# EAGLE design TSOC-ESP8266-EM (EAGLE 6.6.0)
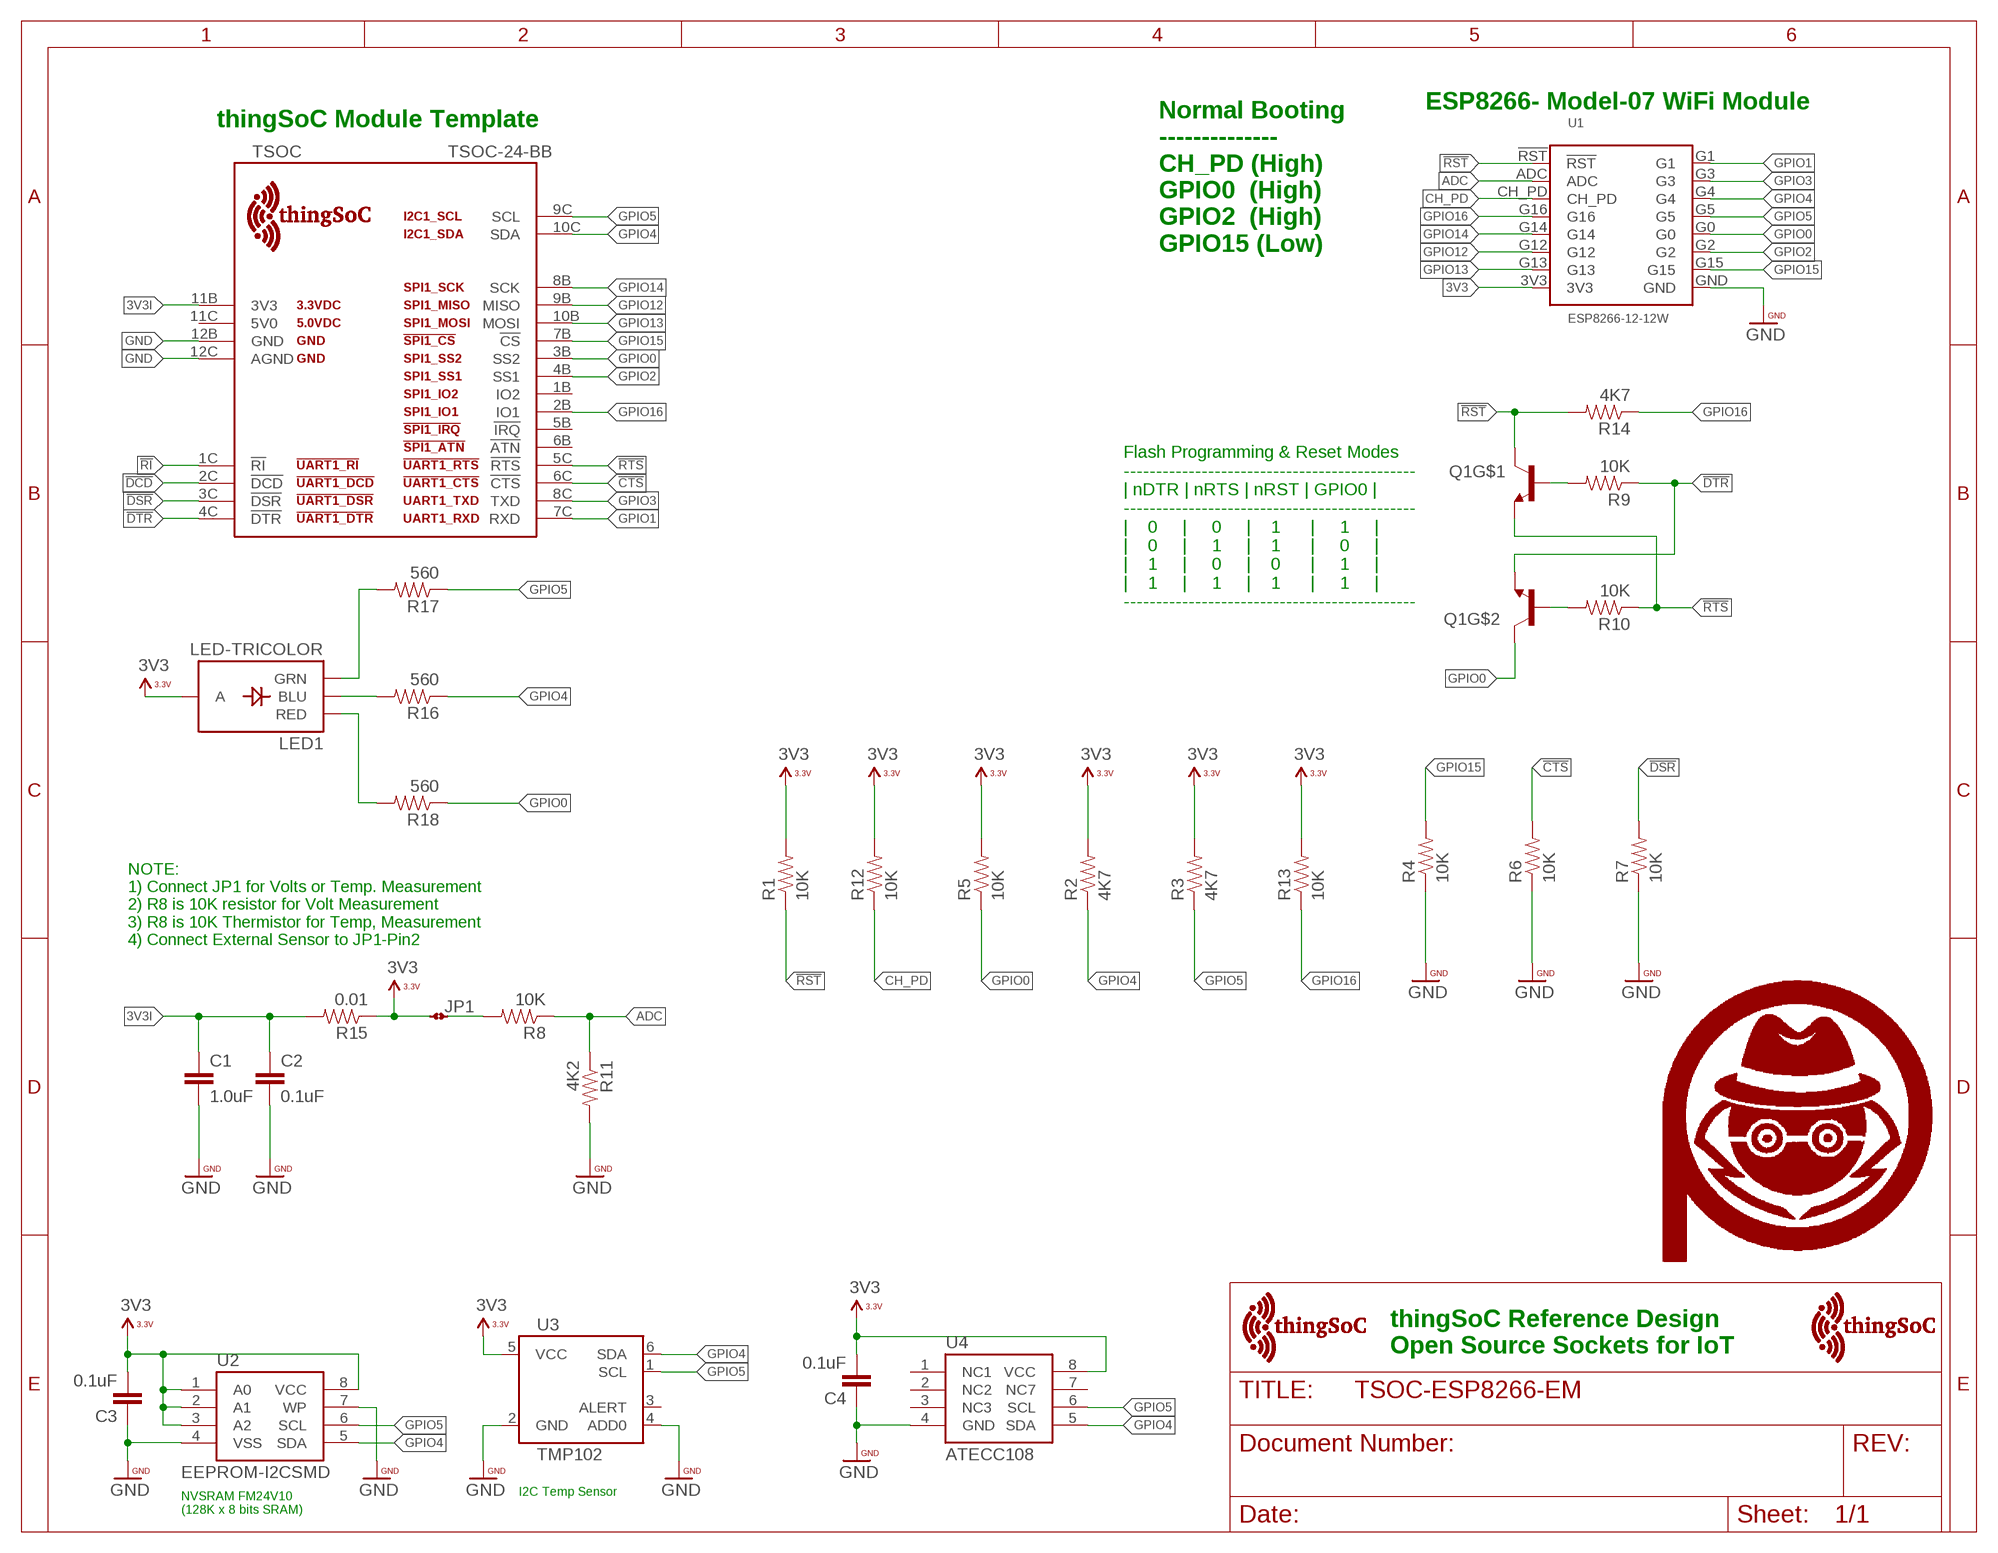
[diagram p0: schematic, sheet 1]

## Parts
C1  1.0uF  CAP0402-CAP  [0402-CAP]
C2  0.1uF  CAP0402-CAP  [0402-CAP]
C3  0.1uF  CAP0402-CAP  [0402-CAP]
C4  0.1uF  CAP0402-CAP  [0402-CAP]
JP1  JMP-2-NO-0402  [JMP-2-NO-0402]
LED1  LED-TRICOLOR  [LED-TRICOLOR-SMD]
Q1  MMBT2222A  MMDT3904  [SOT363]
R1  10K  RESISTOR0402  [0402-RES]
R2  4K7  RESISTOR0402  [0402-RES]
R3  4K7  RESISTOR0402  [0402-RES]
R4  10K  RESISTOR0402  [0402-RES]
R5  10K  RESISTOR0402  [0402-RES]
R6  10K  RESISTOR0402  [0402-RES]
R7  10K  RESISTOR0402  [0402-RES]
R8  10K  RESISTOR0402  [0402-RES]
R9  10K  RESISTOR0402  [0402-RES]
R10  10K  RESISTOR0402  [0402-RES]
R11  4K2  RESISTOR0402  [0402-RES]
R12  10K  RESISTOR0402  [0402-RES]
R13  10K  RESISTOR0402  [0402-RES]
R14  4K7  RESISTOR0402  [0402-RES]
R15  0.01  RESISTOR0402  [0402-RES]
R16  560  RESISTOR0402  [0402-RES]
R17  560  RESISTOR0402  [0402-RES]
R18  560  RESISTOR0402  [0402-RES]
TSOC  TSOC-24-BB  [TSOC-BB-S24]
U1  ESP8266-12-12W  [ESP8266-12W]
U2  EEPROM-I2CSMD  [SO08]
U3  TMP102  [SOT563]
U4  ATECC108  [SOIC8]
U$11  PA_LOGO_SYMMED  [PA_LOGO_AGENT_MED_SYM]
U$19  TSOC-LOGO-MED  [TSOC-LOGO-MED]
U$20  TSOC-LOGO-MED  [TSOC-LOGO-MED]

## Nets
3V3: C3.2 C4.2 JP1.1 LED1.A R1.2 R2.2 R3.2 R5.2 R12.2 R13.2 R15.1 U1.3V3 U2.1(A0) U2.2(A1) U2.3(A2) U2.8(VCC) U3.5(VCC) U4.8(VCC)
3V3I: C1.1 C2.1 R15.2 TSOC.11B(3V3)
!CTS: R6.2 TSOC.6C(!CTS)
!DCD: TSOC.2C(!DCD)
!DSR: R7.2 TSOC.3C(!DSR)
!DTR: Q1.1(E) R9.1 TSOC.4C(!DTR)
!RI: TSOC.1C(!RI)
!RST: Q1.3(C) R1.1 R14.2 U1.!RST
!RTS: Q1.4(E) R10.1 TSOC.5C(!RTS)
ADC: R8.1 R11.1 U1.ADC
ADC_RAW: JP1.2 R8.2
BLU: LED1.B(BLU) R16.2
CH_PD: R12.1 U1.CH_PD
GND: C1.2 C2.2 C3.1 C4.1 R4.1 R6.1 R7.1 R11.2 TSOC.12B(GND) TSOC.12C(AGND) U1.GND U2.4(VSS) U2.7(WP) U3.2(GND) U3.4(ADD0)
GPIO0: Q1.6(C) R5.1 R18.1 TSOC.3B(SS2) U1.G0
GPIO1: TSOC.7C(RXD) U1.G1
GPIO2: TSOC.4B(SS1) U1.G2
GPIO3: TSOC.8C(TXD) U1.G3
GPIO4: R2.1 R16.1 TSOC.10C(SDA) U1.G4 U2.5(SDA) U3.6(SDA) U4.5(SDA)
GPIO5: R3.1 R17.1 TSOC.9C(SCL) U1.G5 U2.6(SCL) U3.1(SCL) U4.6(SCL)
GPIO12: TSOC.9B(MISO) U1.G12
GPIO13: TSOC.10B(MOSI) U1.G13
GPIO14: TSOC.8B(SCK) U1.G14
GPIO15: R4.2 TSOC.7B(!CS) U1.G15
GPIO16: R13.1 R14.1 TSOC.2B(IO1) U1.G16
GRN: LED1.G(GRN) R17.2
N$6: Q1.5(B) R9.2
N$12: Q1.2(B) R10.2
RED: LED1.R(RED) R18.2
Unconnected: TSOC.1B(IO2) TSOC.5B(!IRQ) TSOC.6B(!ATN) TSOC.11C(5V0) U3.3(ALERT) U4.1(NC1) U4.2(NC2) U4.3(NC3) U4.7(NC7)

## Notes on the sheet
- ESP8266- Model-07 WiFi Module
- thingSoC Module Template
- Normal Booting
  --------------
  CH_PD (High)
  GPIO0  (High)
  GPIO2  (High) 
  GPIO15 (Low)
- Flash Programming & Reset Modes
  ---------------------------------------------
  | nDTR | nRTS | nRST | GPIO0 |
  ---------------------------------------------
  |    0     |     0     |    1      |     1     |
  |    0     |     1     |    1      |     0     |
  |    1     |     0     |    0      |     1     |
  |    1     |     1     |    1      |     1     |
  ---------------------------------------------
- NOTE:
  1) Connect JP1 for Volts or Temp. Measurement
  2) R8 is 10K resistor for Volt Measurement
  3) R8 is 10K Thermistor for Temp, Measurement
  4) Connect External Sensor to JP1-Pin2
- thingSoC Reference Design
  Open Source Sockets for IoT
- I2C Temp Sensor
- NVSRAM FM24V10
  (128K x 8 bits SRAM)

## Power pins joined to a net without a drawn wire
GND: U4.4(GND)

## Library data of the parts
C1-C4 = PatternAgents-ProtoPads:CAP: Capacitor Standard 0603 ceramic capacitor, and 0.1" leaded capacitor.
JP1 = PatternAgents-ProtoPads:JMP-2-NO: Two Terminal Jumper - Normally Open Positions 1 and 2 are normally NOT connected. PatternAgents ProtoPads Library Schematic and PCB layout libraries for design patterns by PatternAgents. For the CADSoft Eagle CAD program : http://www.cadsoftusa.com/download-eagle/ Source LBR : http://www.patternagents.com Github : https://github.com/PatternAgents License : http://creativecommons.org/licenses/by-sa/4.0/ (Creative Commons 4.0) THIS SOFTWARE IS PROVIDED BY THE CONTRIBUTORS "AS IS" AND WITHOUT ANY EXPRESS OR IMPLIED WARRANTIES, INCLUDING, BUT NOT LIMITED TO, THE IMPLIED WARRANTIES OF MERCHANTABILITY AND FITNESS FOR A PARTICULAR PURPOSE ARE DISCLAIMED. IN NO EVENT SHALL THE COPYRIGHT OWNER OR CONTRIBUTORS BE LIABLE FOR ANY DIRECT, INDIRECT, INCIDENTAL, SPECIAL, EXEMPLARY, OR CONSEQUENTIAL DAMAGES (INCLUDING, BUT NOT LIMITED TO, PROCUREMENT OF SUBSTITUTE GOODS OR SERVICES; LOSS OF USE, DATA, OR PROFITS; OR BUSINESS INTERRUPTION) HOWEVER CAUSED AND ON ANY THEORY OF LIABILITY, WHETHER IN CONTRACT, STRICT LIABILITY, OR TORT (INCLUDING NEGLIGENCE OR OTHERWISE) ARISING IN ANY WAY OUT OF THE USE OF THIS SOFTWARE, EVEN IF ADVISED OF THE POSSIBILITY OF SUCH DAMAGE.; BOM: EXCLUDE
LED1 = SparkFun-LED:LED-TRICOLOR: Tri-Color LED SMD Proven layout and schematic for triple color LED in SMD package - common anode. Spark Fun Electronics SKU : COM-07844
Q1 = SparkFun-DiscreteSemi:MMDT3904: Dual NPN transistor
R1-R18 = PatternAgents-ProtoPads:RESISTOR: Resistor Basic schematic elements and footprints for 0603, 1206, and PTH resistors.
TSOC = thingSoC:TSOC-24: thingSoC Twenty-Four(24) Pin Socket Source LBR : http://www.thingsoc.com Github : https://github.com/thingsoc License : http://creativecommons.org/licenses/by-sa/4.0/ (Creative Commons 4.0) THIS SOFTWARE IS PROVIDED BY THE CONTRIBUTORS "AS IS" AND WITHOUT ANY EXPRESS OR IMPLIED WARRANTIES, INCLUDING, BUT NOT LIMITED TO, THE IMPLIED WARRANTIES OF MERCHANTABILITY AND FITNESS FOR A PARTICULAR PURPOSE ARE DISCLAIMED. IN NO EVENT SHALL THE COPYRIGHT OWNER OR CONTRIBUTORS BE LIABLE FOR ANY DIRECT, INDIRECT, INCIDENTAL, SPECIAL, EXEMPLARY, OR CONSEQUENTIAL DAMAGES (INCLUDING, BUT NOT LIMITED TO, PROCUREMENT OF SUBSTITUTE GOODS OR SERVICES; LOSS OF USE, DATA, OR PROFITS; OR BUSINESS INTERRUPTION) HOWEVER CAUSED AND ON ANY THEORY OF LIABILITY, WHETHER IN CONTRACT, STRICT LIABILITY, OR TORT (INCLUDING NEGLIGENCE OR OTHERWISE) ARISING IN ANY WAY OUT OF THE USE OF THIS SOFTWARE, EVEN IF ADVISED OF THE POSSIBILITY OF SUCH DAMAGE.
U1 = PatternAgents_RFmodules:ESP8266-12: Pattern Agents ESP8266 (Type12 : 16 Pins) PatternAgents Prototyping/Pads Library Schematic & PCB Layout Symbols for Prototyping Boards. Pads in this library have been lengthened for hand soldering & prototyping. Schematic and PCB layout libraries for design patterns by PatternAgents. For the CADSoft Eagle CAD program : http://www.cadsoftusa.com/download-eagle/ Github : https://github.com/PatternAgents License : http://creativecommons.org/licenses/by-sa/4.0/ (Creative Commons 4.0) THIS SOFTWARE IS PROVIDED BY THE CONTRIBUTORS "AS IS" AND WITHOUT ANY EXPRESS OR IMPLIED WARRANTIES, INCLUDING, BUT NOT LIMITED TO, THE IMPLIED WARRANTIES OF MERCHANTABILITY AND FITNESS FOR A PARTICULAR PURPOSE ARE DISCLAIMED. IN NO EVENT SHALL THE COPYRIGHT OWNER OR CONTRIBUTORS BE LIABLE FOR ANY DIRECT, INDIRECT, INCIDENTAL, SPECIAL, EXEMPLARY, OR CONSEQUENTIAL DAMAGES (INCLUDING, BUT NOT LIMITED TO, PROCUREMENT OF SUBSTITUTE GOODS OR SERVICES; LOSS OF USE, DATA, OR PROFITS; OR BUSINESS INTERRUPTION) HOWEVER CAUSED AND ON ANY THEORY OF LIABILITY, WHETHER IN CONTRACT, STRICT LIABILITY, OR TORT (INCLUDING NEGLIGENCE OR OTHERWISE) ARISING IN ANY WAY OUT OF THE USE OF THIS SOFTWARE, EVEN IF ADVISED OF THE POSSIBILITY OF SUCH DAMAGE.
U2 = SparkFun-DigitalIC:EEPROM-I2C: I2C EEPROM chips, 24LC256 (and others)
U3 = SparkFun-Sensors:TMP102: I2C degC temp sensor; PROD_ID: IC-09303
U4 = SparkFun-DigitalIC:ATECC108: ATECC108: Provides ECDSA with NIST curves P256, B283, and K283. Also, a RNG, 8.5Kb EEPROM. 2.0V - 5.5V.; PROD_ID: IC-11982
U$11 = PatternAgents-Logos:PA_LOGO_SYM: PatternAgents Logo Symbol Trademark : PatternAgents, LLC Github : https://github.com/PatternAgents/PCB_Libraries License : http://creativecommons.org/licenses/by-sa/3.0/ (Creative Commons 3.0) THIS SOFTWARE IS PROVIDED BY THE CONTRIBUTORS "AS IS" AND WITHOUT ANY EXPRESS OR IMPLIED WARRANTIES, INCLUDING, BUT NOT LIMITED TO, THE IMPLIED WARRANTIES OF MERCHANTABILITY AND FITNESS FOR A PARTICULAR PURPOSE ARE DISCLAIMED. IN NO EVENT SHALL THE COPYRIGHT OWNER OR CONTRIBUTORS BE LIABLE FOR ANY DIRECT, INDIRECT, INCIDENTAL, SPECIAL, EXEMPLARY, OR CONSEQUENTIAL DAMAGES (INCLUDING, BUT NOT LIMITED TO, PROCUREMENT OF SUBSTITUTE GOODS OR SERVICES; LOSS OF USE, DATA, OR PROFITS; OR BUSINESS INTERRUPTION) HOWEVER CAUSED AND ON ANY THEORY OF LIABILITY, WHETHER IN CONTRACT, STRICT LIABILITY, OR TORT (INCLUDING NEGLIGENCE OR OTHERWISE) ARISING IN ANY WAY OUT OF THE USE OF THIS SOFTWARE, EVEN IF ADVISED OF THE POSSIBILITY OF SUCH DAMAGE.
U$19 U$20 = thingSoC:TSOC-LOGO: thingSoC Logo Source LBR : http://www.thingsoc.com Github : https://github.com/thingsoc License : http://creativecommons.org/licenses/by-sa/4.0/ (Creative Commons 4.0) THIS SOFTWARE IS PROVIDED BY THE CONTRIBUTORS "AS IS" AND WITHOUT ANY EXPRESS OR IMPLIED WARRANTIES, INCLUDING, BUT NOT LIMITED TO, THE IMPLIED WARRANTIES OF MERCHANTABILITY AND FITNESS FOR A PARTICULAR PURPOSE ARE DISCLAIMED. IN NO EVENT SHALL THE COPYRIGHT OWNER OR CONTRIBUTORS BE LIABLE FOR ANY DIRECT, INDIRECT, INCIDENTAL, SPECIAL, EXEMPLARY, OR CONSEQUENTIAL DAMAGES (INCLUDING, BUT NOT LIMITED TO, PROCUREMENT OF SUBSTITUTE GOODS OR SERVICES; LOSS OF USE, DATA, OR PROFITS; OR BUSINESS INTERRUPTION) HOWEVER CAUSED AND ON ANY THEORY OF LIABILITY, WHETHER IN CONTRACT, STRICT LIABILITY, OR TORT (INCLUDING NEGLIGENCE OR OTHERWISE) ARISING IN ANY WAY OUT OF THE USE OF THIS SOFTWARE, EVEN IF ADVISED OF THE POSSIBILITY OF SUCH DAMAGE.

## Board
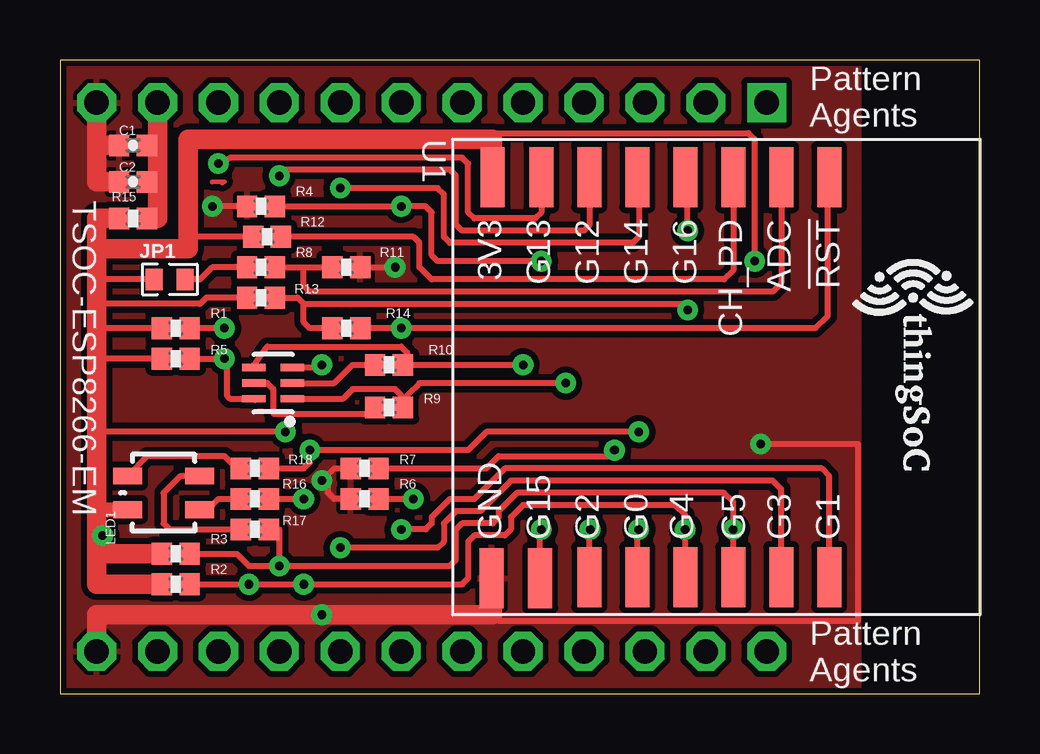
[diagram p1: board, top side]
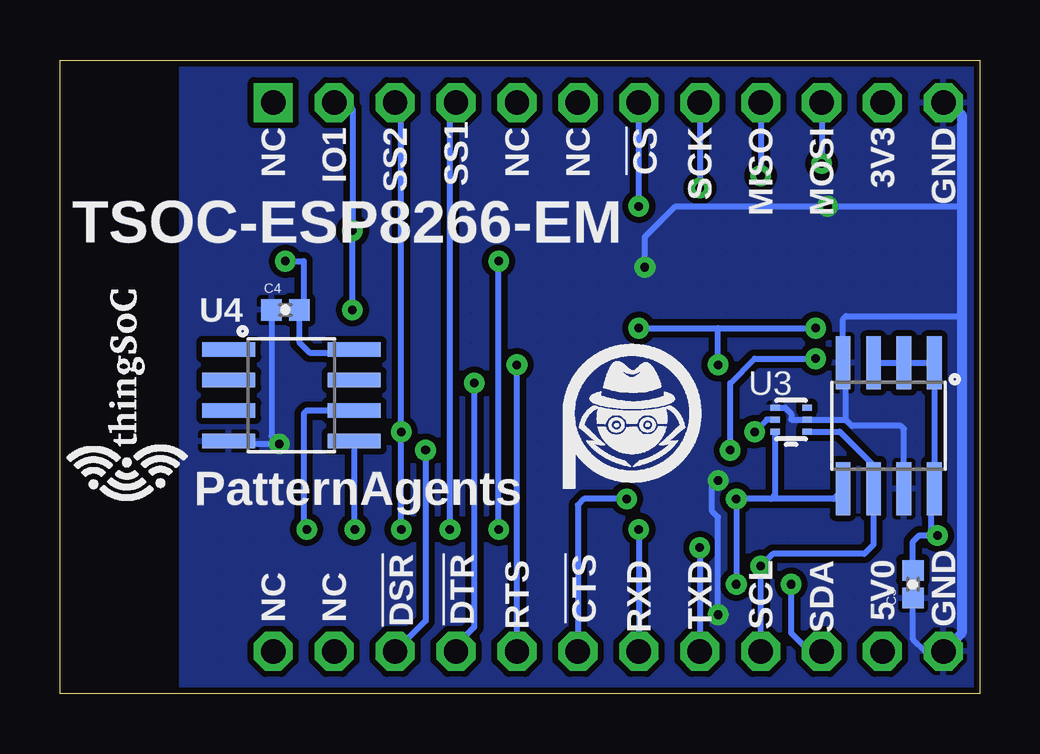
[diagram p2: board, bottom side, seen from below]

Size 38.35 x 26.42 mm. Coordinates in mm from the lower left corner, seen from the top.
Outline: 0,0 38.35,0 38.35,26.42 0,26.42 0,0
Copper layers (1*16): Top 0.035mm / dielectric 1.5mm / Bottom 0.035mm
Design rules "PatternAgents_7mil": minimum track width 7mil, minimum drill 14mil, track to track 7mil, track to pad 7mil, pad to pad 7mil, via to via 7mil, smd to smd 7mil, copper to edge 7mil, drill to drill 7mil, minimum pad ring 12mil, minimum via ring 10mil, stop-mask expansion 4mil, vias tented up to drill 25mil, thermal gap 7mil

### Footprints (pad centres in the part's own frame; a part is rotated, then mirrored left to right if it is on the bottom)
0402-CAP = smd 0.85 x 0.9: 1 -0.58,0; 2 0.58,0
JMP-2-NO-0402 = smd 0.7 x 0.9: 1 -0.65,0; 2 0.65,0
LED-TRICOLOR-SMD = smd 0.7 x 1.2: A 0.7,-1.5; B 0.7,1.5; G -0.7,1.5; R -0.7,-1.5
SOT363 = smd 0.3 x 0.99: 1 -0.65,-0.8; 2 0,-0.8; 3 0.65,-0.8; 4 0.65,0.81; 5 0,0.81; 6 -0.65,0.81
0402-RES = smd 0.85 x 0.9: 1 -0.58,0; 2 0.58,0
TSOC-BB-S24 = drill 1.016 square: 1B -11.43,-11.43 | drill 1.016 octagon: 1C -11.43,11.43; 2B -8.89,-11.43; 2C -8.89,11.43; 3B -6.35,-11.43; 3C -6.35,11.43; 4B -3.81,-11.43; 4C -3.81,11.43; 5B -1.27,-11.43; 5C -1.27,11.43; 6B 1.27,-11.43; 6C 1.27,11.43; 7B 3.81,-11.43; 7C 3.81,11.43; 8B 6.35,-11.43; 8C 6.35,11.43; 9B 8.89,-11.43; 9C 8.89,11.43; 10B 11.43,-11.43; 10C 11.43,11.43; 11B 13.97,-11.43; 11C 13.97,11.43; 12B 16.51,-11.43; 12C 16.51,11.43
ESP8266-12W = smd 1 x 2.5: 3V3 8.888,-8.582; !RST -5.144,-8.582; ADC -3.144,-8.582; CH_PD -1.144,-8.582; G0 2.856,8.082; G1 -5.144,8.082; G2 4.856,8.082; G3 -3.144,8.082; G4 0.856,8.082; G5 -1.144,8.082; G12 4.856,-8.582; G13 6.856,-8.582; G14 2.856,-8.582; G15 6.904,8.126; G16 0.856,-8.582; GND 8.936,8.126
SO08 = smd 0.61 x 2.21: 1 -1.905,-2.616; 2 -0.635,-2.616; 3 0.635,-2.616; 4 1.905,-2.616; 5 1.905,2.616; 6 0.635,2.616; 7 -0.635,2.616; 8 -1.905,2.616
SOT563 = smd 0.25 x 0.4: 1 -0.5,-0.66; 2 0,-0.66; 3 0.5,-0.66; 4 0.5,0.66; 5 0,0.66; 6 -0.5,0.67
SOIC8 = smd 0.61 x 2.21: 1 -1.905,-2.616; 2 -0.635,-2.616; 3 0.635,-2.616; 4 1.905,-2.616; 5 1.905,2.616; 6 0.635,2.616; 7 -0.635,2.616; 8 -1.905,2.616

### Placement (x,y rotation side)
C1  3.05,22.86 180 top
C2  3.05,21.34 180 top
C3  2.79,4.57 90 bottom
C4  28.96,16 0 bottom
JP1  4.57,17.27 0 top
LED1  4.32,8.38 270 top
Q1  8.89,12.95 90 top
R1  4.83,15.24 180 top
R2  4.83,4.57 180 top
R3  4.83,5.84 180 top
R4  8.38,20.32 0 top
R5  4.83,13.97 180 top
R6  12.7,8.13 0 top
R7  12.7,9.4 0 top
R8  8.38,17.78 180 top
R9  13.72,11.94 180 top
R10  13.72,13.72 180 top
R11  11.94,17.78 0 top
R12  8.64,19.05 180 top
R13  8.38,16.51 180 top
R14  11.94,15.24 0 top
R15  3.05,19.81 0 top
R16  8.13,8.13 180 top
R17  8.13,6.86 180 top
R18  8.13,9.4 180 top
TSOC  18.03,13.21 180 top
U1  26.92,12.95 180 top
U2  3.81,11.18 180 bottom
U3  7.87,11.43 90 bottom
U4  28.7,12.45 270 bottom
U$11  14.48,11.18 0 bottom
U$19  35.56,9.65 90 bottom
U$20  35.56,16.51 270 top

### Tracks (layer width: path | path; a pad name or v marks a point on that pad's centre or on a via)
3V3  (via drill 0.36)
  Top 0.178: v1.78,6.6 1.52,6.6
  Top 0.254: R12.2 5.33,19.05 | R1.2 1.52,15.24 | JP1.1 1.52,17.27 | R13.2 6.1,16.51 5.84,16.26 1.78,16.26 1.52,16.51 | R5.2 1.52,13.97 | v9.4,10.92 1.78,10.92 1.52,11.18 | U1.3V3 18.04,23.37 18.03,23.37 28.7,23.37 28.96,23.11 v28.96,18.03
  Top 0.61: 1.5,10.39 1.52,10.67 | LED1.A 1.72,7.68 1.52,7.87
  Top 0.813: 1.52,18.54 1.52,19.81 R15.1 | 1.52,18.54 1.52,17.27 1.52,16.51 1.52,15.24 1.52,13.97 1.52,11.18 1.52,10.67 1.52,7.87 1.52,6.6 1.52,5.84 | 1.52,5.84 1.52,4.57 R2.2 | R3.2 1.52,5.84 | U1.3V3 18.03,23.11 5.33,23.11 5.33,19.05 5.33,18.54 1.52,18.54
  Bottom 0.178: v1.78,6.6 2.03,6.6
  Bottom 0.254: U2.3 U2.2 U2.1 U2.8 2.03,8.43 2.03,6.6 | U3.5 8.89,11.43 v9.4,10.92 | U4.8 26.21,14.22 27.94,14.22 28.38,14.66 C4.2 28.19,16.18 28.19,18.03 v28.96,18.03 | C3.2 2.79,6.35 2.54,6.6 v1.78,6.6
3V3I
  Top 0.813: TSOC.11B 4.06,22.86 | 4.06,22.86 4.06,21.34 | 4.06,21.34 4.06,19.81 R15.2 | C1.1 4.06,22.86 | C2.1 4.06,21.34
!CTS  (via drill 0.36)
  Top 0.254: R6.2 v14.73,8.13
  Bottom 0.254: v14.73,8.13 16.51,8.13 16.76,7.87 TSOC.6C
!DSR  (via drill 0.36)
  Top 0.254: R7.2 17.78,9.4 18.29,9.91 22.86,9.91 v23.11,10.16
  Bottom 0.254: v23.11,10.16 23.11,3.05 TSOC.3C
!DTR  (via drill 0.36)
  Top 0.254: 14.55,12.19 R9.1 | R9.1 14.3,12.37 13.97,12.7 12.19,12.7 11.8,12.3 Q1.1 | v21.08,12.95 14.99,12.95 14.48,12.45 14.48,12.12 R9.1
  Bottom 0.254: TSOC.4C 21.84,2.03 21.08,2.79 v21.08,12.95
!RST  (via drill 0.36)
  Top 0.178: U1.!RST 32,21.59 32,21.47
  Top 0.254: 32,21.47 32,15.75 31.5,15.24 v14.22,15.24 R14.2 12.45,15.17 | Q1.3 10.81,13.6 v10.92,13.72 | v6.86,15.24 R1.1
  Bottom 0.254: v14.22,15.24 10.92,15.24 | 10.92,15.24 v6.86,15.24 | v10.92,13.72 10.92,15.24
!RTS  (via drill 0.36)
  Top 0.254: v19.3,13.72 R10.1 14.48,13.9 14.48,14.22 14.22,14.48 8.64,14.48 8.08,13.67 Q1.4
  Bottom 0.254: TSOC.5C v19.3,13.72
ADC
  Top 0.254: R8.1 10.16,17.78 | 10.16,17.78 R11.1 | U1.ADC 30.07,17.11 29.72,16.76 10.41,16.76 10.16,17.02 10.16,17.78
ADC_RAW
  Top 0.254: R8.2 6.35,17.78 5.84,17.27 JP1.2
BLU
  Top 0.254: 7.29,8.38 R16.2 6.6,8.13 6.16,7.68 LED1.B
CH_PD
  Top 0.254: U1.CH_PD 28.07,17.65 27.69,17.27 15.49,17.27 14.99,17.78 14.99,18.8 14.73,19.05 R12.1
GND  (via drill 0.36)
  Top 0.178: R6.1 11.94,8.38 12.03,8.38 | R7.1 12.19,9.4 12.19,9.31 | R6.1 12.19,8.13 12.21,8.21 | 12.19,8.38 R6.1
  Top 0.254: R4.1 v6.35,20.32 | R11.2 v13.97,17.78 | R7.1 11.43,9.4 v10.92,8.89 11.18,8.64 11.18,8.38 11.43,8.13 R6.1 | 18.03,4.83 18.03,3.3 18.29,3.05 33.27,3.05 33.27,10.41 v29.21,10.41
  Top 0.61: U1.GND 18.03,4.83 18.03,4.06
  Top 0.813: 18.03,4.06 18.03,3.3 v10.92,3.3 1.52,3.3 TSOC.12C | TSOC.12B 1.52,22.86 | 1.52,22.86 C1.2 | C2.2 1.52,21.34 1.52,22.86
  Bottom 0.254: 0.76,20.32 v6.35,20.32 12.7,20.32 13.97,19.05 v13.97,17.78 | v10.92,3.3 10.92,7.37 11.18,7.62 11.18,8.64 v10.92,8.89 | U2.7 3.17,11.05 3.3,11.18 5.33,11.18 5.59,11.43 | 5.59,11.43 5.59,13.66 U2.4 5.71,15.62 5.59,15.75 0.76,15.75 | U3.4 8.12,11.93 7.87,11.68 7.87,11.43 U3.2 5.59,11.43 | U4.4 31.19,10.41 v29.21,10.41 29.54,10.74 C4.1 | TSOC.12C 2.29,1.78 2.79,2.29 C3.1
  Bottom 0.406: TSOC.12B 1.27,24.64 0.76,24.13 0.76,20.32 0.76,15.75 0.76,2.54 TSOC.12C
  pour Bottom (isolate 0.254, hatched): -0.25,-0.25 -0.25,26.67 33.27,26.67 33.27,-0.25
  pour Top (isolate 0.254, hatched): -0.25,-0.25 -0.25,26.67 33.27,26.67 33.27,-0.25
GPIO0  (via drill 0.36)
  Top 0.254: U1.G0 24.07,6.8 v24.13,6.86 | R5.1 v6.86,13.97 6.97,13.86 6.97,12.42 7.08,12.3 Q1.6 8.13,12.26 | v24.13,10.92 17.78,10.92 17.02,10.16 v10.41,10.16 10.41,9.65 10.16,9.4 R18.1
  Bottom 0.254: v24.13,6.86 v24.13,10.92 24.13,24.38 TSOC.3B | v10.41,10.16 10.41,12.95 9.4,13.97 v6.86,13.97
GPIO1  (via drill 0.36)
  Top 0.254: U1.G1 32.07,9.08 31.75,9.4 18.54,9.4 17.27,8.13 16.26,8.13 15.49,7.37 15.49,7.11 15.24,6.86 v14.22,6.86
  Bottom 0.254: v14.22,6.86 TSOC.7C
GPIO2  (via drill 0.36)
  Top 0.254: U1.G2 22.07,6.83 v22.1,6.86
  Bottom 0.254: v22.1,6.86 22.1,24.38 TSOC.4B
GPIO3  (via drill 0.36)
  Top 0.254: U1.G3 30.07,8.54 29.72,8.89 18.8,8.89 17.53,7.62 16.51,7.62 16,7.11 16,6.35 15.75,6.1 v11.68,6.1
  Bottom 0.254: v11.68,6.1 TSOC.8C
GPIO4  (via drill 0.36)
  Top 0.254: U1.G4 v26.07,6.86 26.07,7.46 25.65,7.87 19.3,7.87 18.8,7.37 18.8,6.86 18.54,6.6 17.27,6.6 17.02,6.35 17.02,4.83 16.76,4.57 v10.16,4.57 v7.87,4.57 R2.1 | R16.1 v10.16,8.13
  Bottom 0.254: TSOC.10C 7.11,1.78 7.87,2.54 v7.87,4.57 | U2.5 5.71,8.51 6.1,8.13 R16.1 | R16.1 v10.16,8.13 v10.16,4.57 | U3.6 8.54,8.29 R16.1 | U4.5 26.09,6.88 v26.07,6.86
GPIO5  (via drill 0.36)
  Top 0.254: U1.G5 v28.07,6.86 28.07,8 27.69,8.38 19.05,8.38 18.29,7.62 18.29,7.37 18.03,7.11 16.76,7.11 16.51,6.86 16.51,5.59 16.26,5.33 v9.14,5.33 | R3.1 7.37,5.84 7.87,5.33 v9.14,5.33 | R17.1 9.14,6.86 v9.14,5.33
  Bottom 0.254: TSOC.9C v9.14,5.33 8.64,5.84 4.83,5.84 4.45,6.22 U2.6 4.32,8.69 4.32,9.4 5.85,10.93 U3.1 | U4.6 28.07,11.81 28.19,11.68 28.19,6.98 v28.07,6.86
GPIO12  (via drill 0.36)
  Top 0.254: U1.G12 22.07,19.53 21.84,19.3 16.76,19.3 16.51,19.56 16.51,21.59 16.26,21.84 9.4,21.84 v9.14,21.59
  Bottom 0.254: TSOC.9B v9.14,21.59
GPIO13  (via drill 0.36)
  Top 0.254: U1.G13 20.07,20.07 19.81,19.81 17.27,19.81 17.02,20.07 17.02,22.1 16.76,22.35 7.11,22.35 v6.6,22.1
  Bottom 0.254: TSOC.10B v6.6,22.1
GPIO14  (via drill 0.36)
  Top 0.254: U1.G14 24.13,21.47 24.13,19.05 23.88,18.8 16.26,18.8 16,19.05 16,20.83 15.75,21.08 v11.68,21.08
  Bottom 0.254: TSOC.8B v11.68,21.08
GPIO15  (via drill 0.36)
  Top 0.254: U1.G15 20.02,6.56 v20.07,6.86 | v20.07,18.03 15.75,18.03 15.49,18.29 15.49,20.07 15.24,20.32 v14.22,20.32 R4.2
  Bottom 0.254: v20.07,6.86 v20.07,18.03 | v14.22,20.32 TSOC.7B
GPIO16  (via drill 0.36)
  Top 0.254: 26.16,21.63 U1.G16 26.16,21.44 v26.16,19.3 | R13.1 9.91,16.51 10.16,16.26 | 10.16,16.26 25.91,16.26 v26.16,16 | R14.1 10.41,15.24 10.16,15.49 10.16,16.26
  Bottom 0.254: v26.16,16 v26.16,19.3 26.16,24.38 26.42,24.64 TSOC.2B
GRN
  Top 0.254: LED1.G 5.02,9.08 4.32,8.38 4.32,7.11 4.57,6.86 R17.2
N$1
  Top 0.178: 6.77,21.29 6.86,21.34 6.35,21.34 6.35,21.32
N$6
  Top 0.254: Q1.5 8.64,12.95 8.89,12.7 8.89,11.68 12.88,11.68 R9.2
N$12
  Top 0.254: Q1.2 11.43,12.95 12.19,13.72 R10.2
RED
  Top 0.254: R18.2 7.37,9.4 6.86,9.91 3.64,9.91 LED1.R

### Text on the board
tPlace: Pattern / Agents | TSOC-ESP8266-EM | Pattern / Agents
bPlace: GND | 3V3 | MOSI | MISO | SCK | !CS | NC | NC | SS1 | SS2 | IO1 | NC | TSOC-ESP8266-EM | U3 | PatternAgents | 5V0 | SDA | SCL | TXD | RXD | !CTS | RTS | !DTR | !DSR | NC | NC | GND